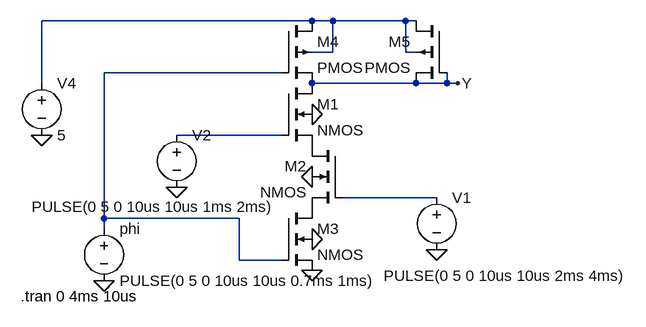
[diagram p0: schematic DynamicNAND.asc]
DynamicNAND.asc, the LTspice schematic file:
Version 4
SHEET 1 880 680
WIRE 224 32 -192 32
WIRE 256 32 224 32
WIRE 368 32 256 32
WIRE 384 32 368 32
WIRE 256 80 256 32
WIRE 256 80 224 80
WIRE 368 80 368 32
WIRE 384 80 368 80
WIRE 176 112 -96 112
WIRE -192 128 -192 32
WIRE 384 128 224 128
WIRE 432 128 432 112
WIRE 432 128 384 128
WIRE 448 128 432 128
WIRE 176 208 16 208
WIRE 416 304 272 304
WIRE -96 336 -96 112
WIRE 112 336 -96 336
WIRE -96 352 -96 336
WIRE 112 400 112 336
WIRE 176 400 112 400
FLAG 16 288 0
FLAG 416 384 0
FLAG 224 416 0
FLAG 224 272 0
FLAG 224 176 0
FLAG -96 432 0
FLAG -192 208 0
FLAG 224 368 0
FLAG 448 128 Y
SYMBOL nmos4 176 128 R0
SYMATTR InstName M1
SYMATTR Value2 l=2 w=10
SYMBOL nmos4 272 224 M0
SYMATTR InstName M2
SYMATTR Value2 l=2 w=10
SYMBOL nmos4 176 320 R0
SYMATTR InstName M3
SYMATTR Value2 l=2 w=10
SYMBOL pmos4 176 32 R0
SYMATTR InstName M4
SYMATTR Value2 l=2 w=10
SYMBOL voltage 416 288 R0
WINDOW 123 0 0 Left 2
WINDOW 39 0 0 Left 2
WINDOW 3 -82 136 Left 2
SYMATTR InstName V1
SYMATTR Value PULSE(0 5 0 10us 10us 2ms 4ms)
SYMBOL voltage 16 192 R0
WINDOW 123 0 0 Left 2
WINDOW 39 0 0 Left 2
WINDOW 3 -223 126 Left 2
SYMATTR InstName V2
SYMATTR Value PULSE(0 5 0 10us 10us 1ms 2ms)
SYMBOL voltage -96 336 R0
WINDOW 123 0 0 Left 2
WINDOW 39 0 0 Left 2
SYMATTR InstName phi
SYMATTR Value PULSE(0 5 0 10us 10us 0.7ms 1ms)
SYMBOL voltage -192 112 R0
WINDOW 123 0 0 Left 2
WINDOW 39 0 0 Left 2
SYMATTR InstName V4
SYMATTR Value 5
SYMBOL pmos4 432 32 M0
SYMATTR InstName M5
SYMATTR Value2 l=20 w=1
TEXT -224 456 Left 2 !.tran 0 4ms 10us

The netlist it stands for:
* DynamicNAND.asc
M1 Y N003 P001 0 NMOS l=2 w=10
M2 P001 N004 P002 0 NMOS l=2 w=10
M3 P002 N002 0 0 NMOS l=2 w=10
M4 N001 N002 Y N001 PMOS l=2 w=10
V1 N004 0 PULSE(0 5 0 10us 10us 2ms 4ms)
V2 N003 0 PULSE(0 5 0 10us 10us 1ms 2ms)
V§phi N002 0 PULSE(0 5 0 10us 10us 0.7ms 1ms)
V4 N001 0 5
M5 N001 Y Y N001 PMOS l=20 w=1
.model NMOS NMOS
.model PMOS PMOS
.lib standard.mos
.tran 0 4ms 10us
.backanno
.end